# EAGLE design clock (EAGLE 5.10)
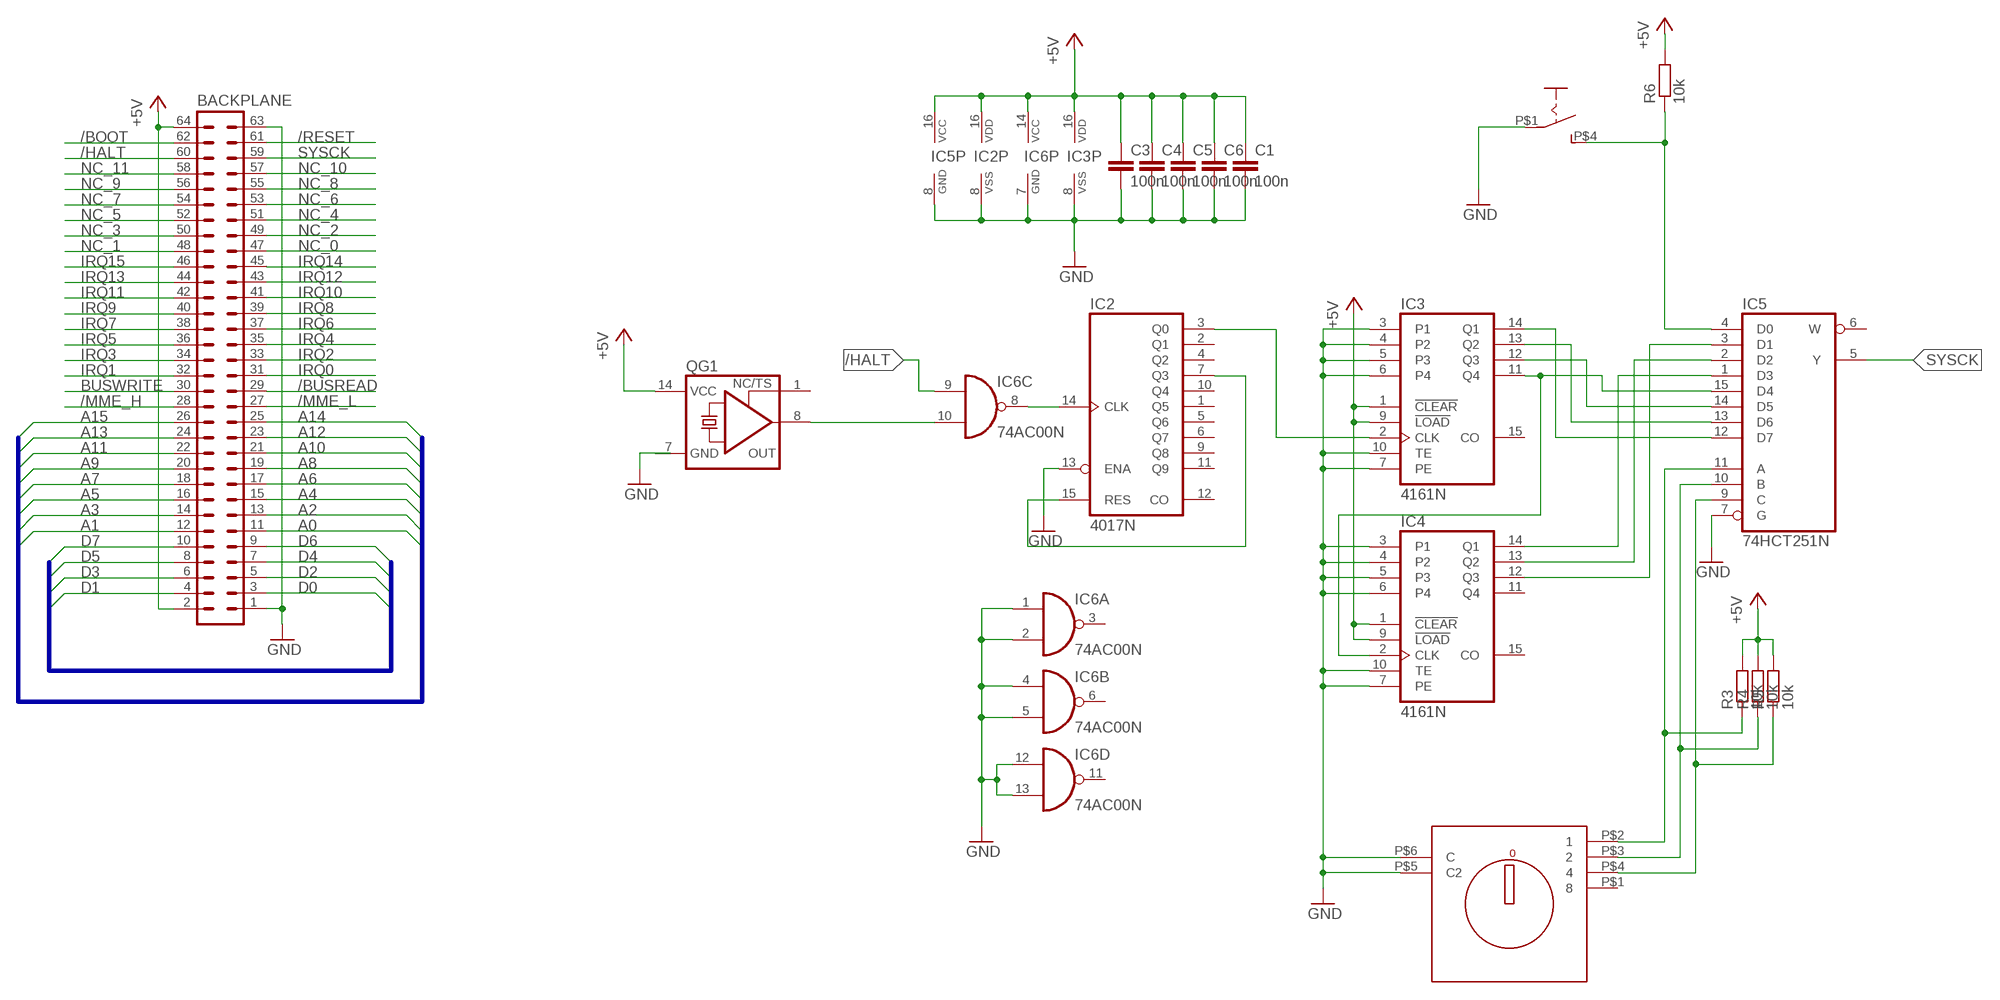
[diagram p0: schematic, sheet 1]

## Parts
BACKPLANE  ML64L  [ML64L]
C1  100n  C-EU025-025X050  [C025-025X050]
C3  100n  C-EU025-025X050  [C025-025X050]
C4  100n  C-EU025-025X050  [C025-025X050]
C5  100n  C-EU025-025X050  [C025-025X050]
C6  100n  C-EU025-025X050  [C025-025X050]
IC2  4017N  [DIL16]
IC3  4161N  [DIL16]
IC4  4161N  [DIL16]
IC5  74HCT251N  [DIL16]
IC6  74AC00N  [DIL14]
QG1  XO-14  [DIL14S]
R3  10k  R-EU_0207/12  [0207/12]
R4  10k  R-EU_0204/5  [0204/5]
R5  10k  R-EU_0207/7  [0207/7]
R6  10k  R-EU_0207/2V  [0207/2V]
U$5  KDR10H  [KDR10H]
U$6  TASTER_3305B  [TASTER_3305B]

## Nets
+5V: BACKPLANE.2 BACKPLANE.64 C1.1 C3.1 C4.1 C5.1 C6.1 IC2.16(VDD) IC3.1(!CLEAR) IC3.9(!LOAD) IC3.16(VDD) IC4.1(!CLEAR) IC4.9(!LOAD) IC5.16(VCC) IC6.14(P:VCC) QG1.14(VCC) R3.2 R4.2 R5.2 R6.2
/BOOT: BACKPLANE.62
/BUSREAD: BACKPLANE.29
/HALT: BACKPLANE.60 IC6.9(C:I0)
/MME_H: BACKPLANE.28
/MME_L: BACKPLANE.27
/RESET: BACKPLANE.61
A0: BACKPLANE.11
A1: BACKPLANE.12
A2: BACKPLANE.13
A3: BACKPLANE.14
A4: BACKPLANE.15
A5: BACKPLANE.16
A6: BACKPLANE.17
A7: BACKPLANE.18
A8: BACKPLANE.19
A9: BACKPLANE.20
A10: BACKPLANE.21
A11: BACKPLANE.22
A12: BACKPLANE.23
A13: BACKPLANE.24
A14: BACKPLANE.25
A15: BACKPLANE.26
BUSWRITE: BACKPLANE.30
D0: BACKPLANE.3
D1: BACKPLANE.4
D2: BACKPLANE.5
D3: BACKPLANE.6
D4: BACKPLANE.7
D5: BACKPLANE.8
D6: BACKPLANE.9
D7: BACKPLANE.10
GND: BACKPLANE.1 BACKPLANE.63 C1.2 C3.2 C4.2 C5.2 C6.2 IC2.8(VSS) IC2.13(ENA) IC3.3(P1) IC3.4(P2) IC3.5(P3) IC3.6(P4) IC3.7(PE) IC3.8(VSS) IC3.10(TE) IC4.3(P1) IC4.4(P2) IC4.5(P3) IC4.6(P4) IC4.7(PE) IC4.10(TE) IC5.7(G) IC5.8(GND) IC6.1(A:I0) IC6.2(A:I1) IC6.4(B:I0) IC6.5(B:I1) IC6.7(P:GND) IC6.12(D:I0) IC6.13(D:I1) U$5.P$5(C2) U$5.P$6(C) U$6.P$1(P)
IRQ0: BACKPLANE.31
IRQ1: BACKPLANE.32
IRQ2: BACKPLANE.33
IRQ3: BACKPLANE.34
IRQ4: BACKPLANE.35
IRQ5: BACKPLANE.36
IRQ6: BACKPLANE.37
IRQ7: BACKPLANE.38
IRQ8: BACKPLANE.39
IRQ9: BACKPLANE.40
IRQ10: BACKPLANE.41
IRQ11: BACKPLANE.42
IRQ12: BACKPLANE.43
IRQ13: BACKPLANE.44
IRQ14: BACKPLANE.45
IRQ15: BACKPLANE.46
N$1: IC6.10(C:I1) QG1.8(OUT)
N$5: IC3.11(Q4) IC4.2(CLK) IC5.15(D4)
N$6: IC2.7(Q3) IC2.15(RES)
N$7: IC2.3(Q0) IC3.2(CLK)
N$8: IC3.14(Q1) IC5.12(D7)
N$9: IC3.13(Q2) IC5.13(D6)
N$10: IC3.12(Q3) IC5.14(D5)
N$11: IC5.11(A) R3.1 U$5.P$2
N$12: IC4.14(Q1) IC5.1(D3)
N$13: IC4.13(Q2) IC5.2(D2)
N$14: IC4.12(Q3) IC5.3(D1)
N$15: IC5.10(B) R4.1 U$5.P$3
N$16: IC5.9(C) R5.1 U$5.P$4
N$17: IC2.14(CLK) IC6.8(C:O)
N$18: IC5.4(D0) R6.1 U$6.P$4(S)
NC_0: BACKPLANE.47
NC_1: BACKPLANE.48
NC_2: BACKPLANE.49
NC_3: BACKPLANE.50
NC_4: BACKPLANE.51
NC_5: BACKPLANE.52
NC_6: BACKPLANE.53
NC_7: BACKPLANE.54
NC_8: BACKPLANE.55
NC_9: BACKPLANE.56
NC_10: BACKPLANE.57
NC_11: BACKPLANE.58
SYSCK: BACKPLANE.59 IC5.5(Y)
Unconnected: IC2.1(Q5) IC2.2(Q1) IC2.4(Q2) IC2.5(Q6) IC2.6(Q7) IC2.9(Q8) IC2.10(Q4) IC2.11(Q9) IC2.12(CO) IC3.15(CO) IC4.11(Q4) IC4.15(CO) IC5.6(W) IC6.3(A:O) IC6.6(B:O) IC6.11(D:O) QG1.1(TS) U$5.P$1

## Buses
D[0..7]
A[0..15]

## Power pins joined to a net without a drawn wire
GND: QG1.7(GND)
VDD: IC4.16(VDD)
VSS: IC4.8(VSS)

## Library data of the parts
BACKPLANE = mcpu:ML64L: HARTING
C1 C3-C6 = rcl:C-EU: CAPACITOR, European symbol
IC2 = 40xx:4017: COUNTER/DIVIDER
IC3 IC4 = 40xx:4161: Synchronous presettable 4-bit binary COUNTER
IC5 = 74xx-eu:74*251: 1 of 8 data SELECTOR/MULTIPLEXER, 3-state
IC6 = 74xx-eu:74*00: Quad 2-input NAND gate
QG1 = crystal:XO-: CRYSTAL
R3-R6 = rcl:R-EU_: RESISTOR, European symbol
U$5 = Drehschalter:KDR10H
U$6 = mcpu:TASTER_3305B

## Net classes
0 Signal: width 0.254 mm, drill 0.508 mm, clearance 0.203 mm
1 LoVolt42: width 0.61 mm, drill 0.508 mm, clearance 0.813 mm to class 0, clearance 0.305 mm
2 MedVolt100: width 0.61 mm, drill 0.508 mm, clearance 1.626 mm to class 0, clearance 1.626 mm to class 1, clearance 0.813 mm
3 LineVolt350: width 0.813 mm, drill 0.508 mm, clearance 12.7 mm to class 0, clearance 12.7 mm to class 1, clearance 12.7 mm to class 2, clearance 2.54 mm

## Board
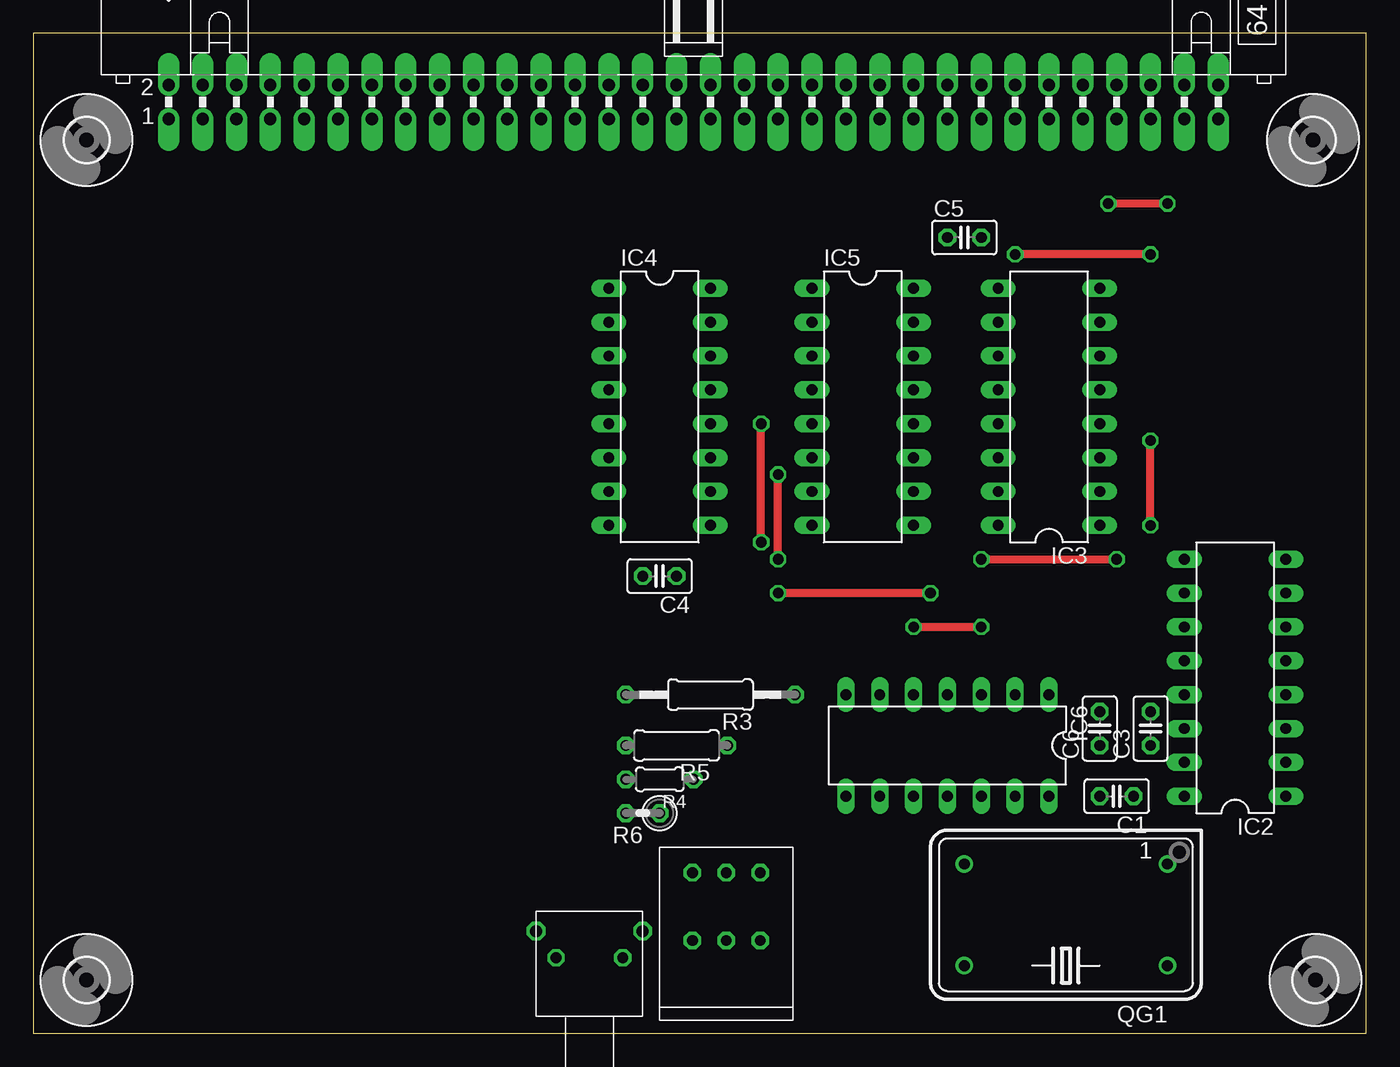
[diagram p1: board, top side]
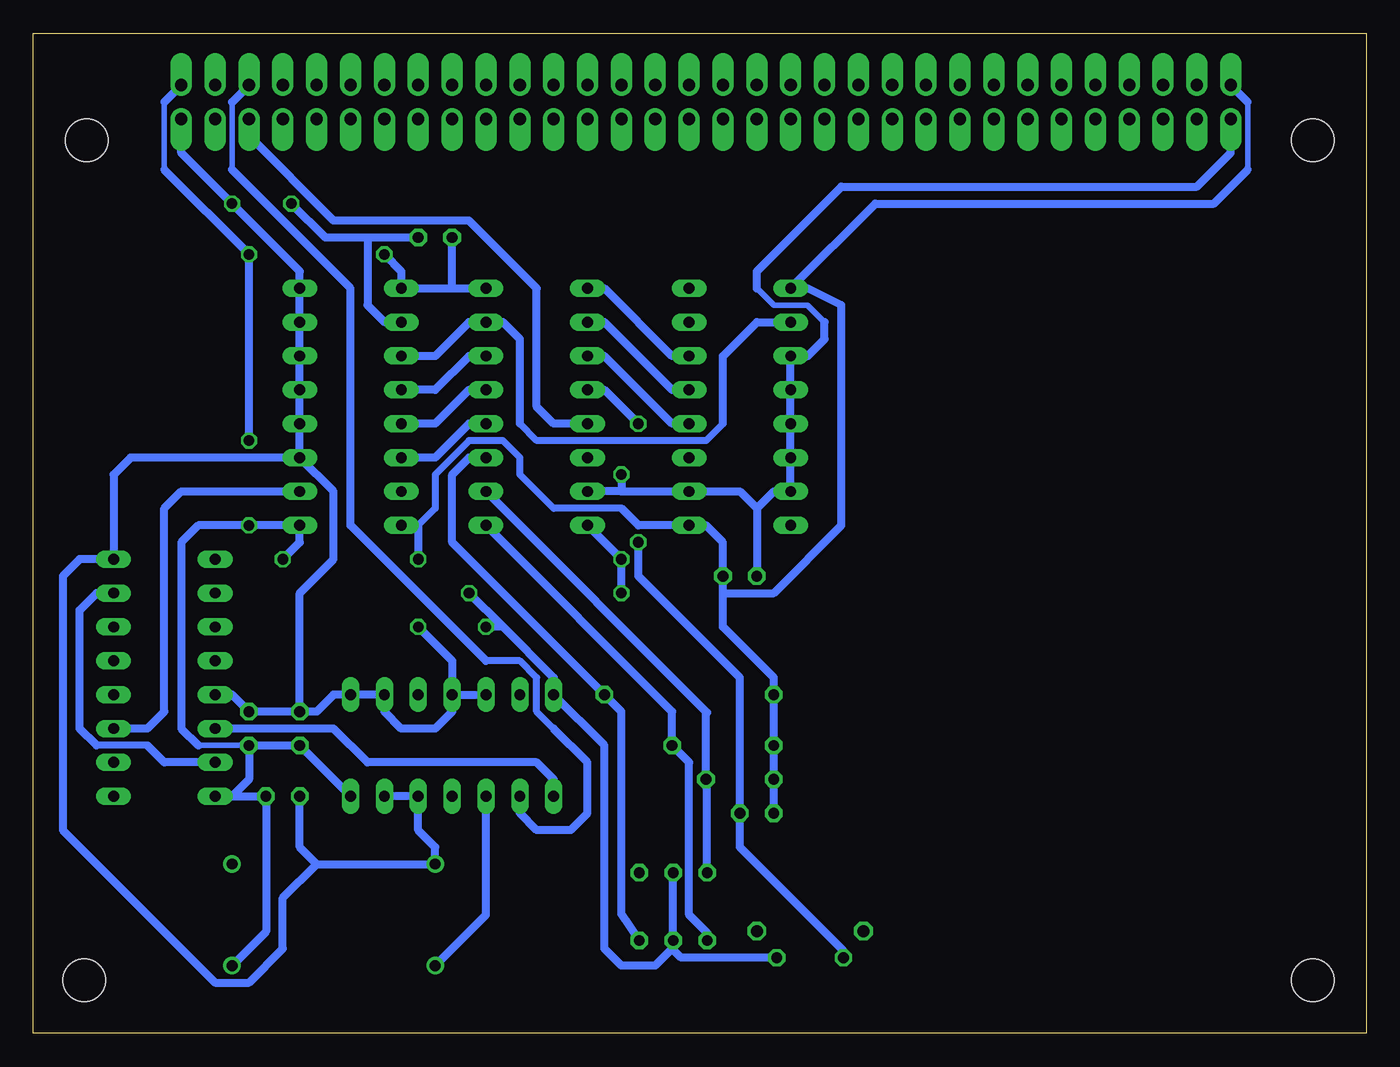
[diagram p2: board, bottom side, seen from below]

Size 100 x 75 mm. Coordinates in mm from the lower left corner, seen from the top.
Outline: 0,0 100,0 100,75 0,75 0,0
Copper layers (1*16): Top 0.035mm / dielectric 1.5mm / Bottom 0.035mm
Design rules "default": minimum track width 10mil, minimum drill 24mil, track to track 8mil, track to pad 8mil, pad to pad 8mil, via to via 8mil, smd to smd 8mil, copper to edge 40mil, drill to drill 8mil, minimum pad ring 10mil, minimum via ring 8mil, stop-mask expansion 4mil, vias tented up to drill 0mil, thermal gap 10mil

### Footprints (pad centres in the part's own frame; a part is rotated, then mirrored left to right if it is on the bottom)
ML64L = drill 0.914 pad 1.6 offset: 1 -39.37,-1.27; 2 -39.37,1.27; 3 -36.83,-1.27; 4 -36.83,1.27; 5 -34.29,-1.27; 6 -34.29,1.27; 7 -31.75,-1.27; 8 -31.75,1.27; 9 -29.21,-1.27; 10 -29.21,1.27; 11 -26.67,-1.27; 12 -26.67,1.27; 13 -24.13,-1.27; 14 -24.13,1.27; 15 -21.59,-1.27; 16 -21.59,1.27; 17 -19.05,-1.27; 18 -19.05,1.27; 19 -16.51,-1.27; 20 -16.51,1.27; 21 -13.97,-1.27; 22 -13.97,1.27; 23 -11.43,-1.27; 24 -11.43,1.27; 25 -8.89,-1.27; 26 -8.89,1.27; 27 -6.35,-1.27; 28 -6.35,1.27; 29 -3.81,-1.27; 30 -3.81,1.27; 31 -1.27,-1.27; 32 -1.27,1.27; 33 1.27,-1.27; 34 1.27,1.27; 35 3.81,-1.27; 36 3.81,1.27; 37 6.35,-1.27; 38 6.35,1.27; 39 8.89,-1.27; 40 8.89,1.27; 41 11.43,-1.27; 42 11.43,1.27; 43 13.97,-1.27; 44 13.97,1.27; 45 16.51,-1.27; 46 16.51,1.27; 47 19.05,-1.27; 48 19.05,1.27; 49 21.59,-1.27; 50 21.59,1.27; 51 24.13,-1.27; 52 24.13,1.27; 53 26.67,-1.27; 54 26.67,1.27; 55 29.21,-1.27; 56 29.21,1.27; 57 31.75,-1.27; 58 31.75,1.27; 59 34.29,-1.27; 60 34.29,1.27; 61 36.83,-1.27; 62 36.83,1.27; 63 39.37,-1.27; 64 39.37,1.27
C025-025X050 = drill 0.813 octagon: 1 -1.27,0; 2 1.27,0
DIL16 = drill 0.813 long: 1 -8.89,-3.81; 2 -6.35,-3.81; 3 -3.81,-3.81; 4 -1.27,-3.81; 5 1.27,-3.81; 6 3.81,-3.81; 7 6.35,-3.81; 8 8.89,-3.81; 9 8.89,3.81; 10 6.35,3.81; 11 3.81,3.81; 12 1.27,3.81; 13 -1.27,3.81; 14 -3.81,3.81; 15 -6.35,3.81; 16 -8.89,3.81
DIL14 = drill 0.813 long: 1 -7.62,-3.81; 2 -5.08,-3.81; 3 -2.54,-3.81; 4 0,-3.81; 5 2.54,-3.81; 6 5.08,-3.81; 7 7.62,-3.81; 8 7.62,3.81; 9 5.08,3.81; 10 2.54,3.81; 11 0,3.81; 12 -2.54,3.81; 13 -5.08,3.81; 14 -7.62,3.81
DIL14S = drill 0.813 round: 1 -7.62,-3.81; 7 7.62,-3.81; 8 7.62,3.81; 14 -7.62,3.81
0207/12 = drill 0.813 octagon: 1 -6.35,0; 2 6.35,0
0204/5 = drill 0.813 octagon: 1 -2.54,0; 2 2.54,0
0207/7 = drill 0.813 octagon: 1 -3.81,0; 2 3.81,0
0207/2V = drill 0.813 octagon: 1 -1.27,0; 2 1.27,0
3,2 = hole 3.2: 0,0
KDR10H = drill 0.8 octagon: P$1 1.92,7.54; P$2 7,7.54; P$3 1.92,2.46; P$4 7,2.46; P$5 7,5; P$6 1.92,5
TASTER_3305B = drill 0.8 octagon: P$1 4.4,1.5; P$4 4.4,6.5 | drill 0.9 octagon: P$2 6.4,8; P$3 6.4,0

### Placement (x,y rotation side)
BACKPLANE  49.53,69.85 0 top
C1  81.28,17.78 180 top
C3  83.82,22.86 90 top
C4  46.99,34.29 180 top
C5  69.85,59.69 0 top
C6  80.01,22.86 90 top
IC2  90.17,26.67 90 top
IC3  76.2,46.99 90 top
IC4  46.99,46.99 270 top
IC5  62.23,46.99 270 top
IC6  68.58,21.59 180 top
QG1  77.47,8.89 180 top
R3  50.8,25.4 180 top
R4  46.99,19.05 180 top
R5  48.26,21.59 180 top
R6  45.72,16.51 180 top
U$1  [3,2]  4,4 0 top
U$2  [3,2]  4,67 0 top
U$3  [3,2]  96,67 0 top
U$4  [3,2]  96.19,4 0 top
U$5  46.99,13.97 270 top
U$6  45.72,1.27 90 top

### Tracks (layer width: path | path; a pad name or v marks a point on that pad's centre or on a via)
+5V  (via drill 0.8)
  Top 0.61: v83.82,58.42 v73.66,58.42 | v83.82,38.1 v83.82,44.45 | v71.12,35.56 v81.28,35.56
  Bottom 0.406: 90.17,64.77 90.17,69.85 | 87.63,21.59 C3.1 | 8.89,64.77 8.89,69.85
  Bottom 0.508: 55.88,39.37 60.96,39.37 63.5,41.91 63.5,43.18 64.77,44.45 67.31,44.45 69.85,41.91 69.85,39.37 71.12,38.1 IC3.16
  Bottom 0.61: 85.09,17.78 IC2.16 | 85.09,17.78 83.82,19.05 C3.1 C6.1 IC6.14 | QG1.14 82.55,7.62 C1.1 85.09,17.78 | 90.17,69.85 BACKPLANE.64 | 90.17,64.77 v83.82,58.42 v83.82,44.45 | v73.66,58.42 72.39,57.15 IC3.9 68.58,55.88 | 68.58,55.88 IC5.16 | 68.58,55.88 C5.1 | 48.26,33.02 48.26,30.48 44.45,26.67 R3.2 R5.2 R4.2 R6.2 | 55.88,39.37 54.61,38.1 IC4.9 49.53,38.1 48.26,36.83 C4.1 48.26,33.02 | 48.26,33.02 44.45,33.02 39.37,38.1 39.37,54.61 41.91,55.88 IC4.1 36.83,62.23 11.43,62.23 8.89,64.77 | 87.63,21.59 88.9,22.86 88.9,36.83 87.63,38.1 v83.82,38.1 IC3.1 80.01,36.83 v81.28,35.56 | 71.12,38.1 v71.12,35.56 | 8.89,69.85 BACKPLANE.2
/HALT
  Bottom 0.406: 85.09,64.77 85.09,69.85
  Bottom 0.508: 60.96,22.86 62.23,24.13 62.23,26.67 63.5,27.94 66.04,27.94
  Bottom 0.61: 66.04,27.94 76.2,38.1 76.2,55.88 85.09,64.77 | 85.09,69.85 BACKPLANE.60 | IC6.9 63.5,16.51 62.23,15.24 59.69,15.24 58.42,16.51 58.42,20.32 60.96,22.86
GND  (via drill 0.8)
  Top 0.61: v66.04,30.48 v71.12,30.48 | v55.88,35.56 v55.88,41.91 | v67.31,33.02 v55.88,33.02 | v85.09,62.23 v80.64,62.23
  Bottom 0.406: 45.72,55.88 44.45,54.61 41.91,54.61 40.64,53.34
  Bottom 0.61: IC3.3 92.71,43.18 93.98,41.91 IC2.8 96.52,35.56 97.79,34.29 97.79,15.24 86.36,3.81 83.82,3.81 81.28,6.35 81.28,10.16 78.74,12.7 | BACKPLANE.63 88.9,66.04 v85.09,62.23 80.01,57.15 IC3.8 IC3.7 IC3.6 IC3.5 IC3.4 IC3.3 | C6.2 78.74,24.13 77.47,25.4 IC6.1 IC6.2 73.66,24.13 72.39,22.86 69.85,22.86 68.58,24.13 IC6.4 | IC6.13 IC6.12 71.12,15.24 69.85,13.97 QG1.7 78.74,12.7 | C1.2 80.01,13.97 78.74,12.7 | 45.72,39.37 44.45,40.64 IC4.7 IC4.6 IC4.5 IC4.4 IC4.3 41.91,50.8 40.64,52.07 40.64,53.34 | 45.72,39.37 C4.2 | 45.72,39.37 46.99,40.64 IC4.10 55.88,40.64 | 55.88,40.64 IC5.7 | IC2.13 85.09,25.4 C3.2 C6.2 | C6.2 80.01,33.02 77.47,35.56 77.47,40.64 IC3.3 | U$5.P$6 U$5.P$5 52.07,6.89 52.07,6.35 | 52.07,6.35 53.34,5.08 55.88,5.08 57.15,6.35 57.15,21.59 IC6.7 60.96,26.67 64.77,30.48 | U$6.P$1 51.39,5.67 52.07,6.35 | 74.93,59.69 C5.2 | 74.93,59.69 74.93,54.61 73.66,53.34 IC3.10 | IC6.4 IC6.5 | IC6.4 68.58,27.94 v71.12,30.48 | 64.77,30.48 v66.04,30.48 | IC5.8 v55.88,35.56 v55.88,33.02 | v55.88,41.91 55.88,40.64 | 64.77,30.48 v67.31,33.02 | 74.93,59.69 78.11,59.69 v80.64,62.23 | BACKPLANE.1 10.16,66.04 12.7,63.5 39.37,63.5 45.72,57.15 45.72,55.88
N$1
  Bottom 0.61: QG1.8 66.04,8.89 IC6.10
N$5
  Bottom 0.508: 48.26,45.72 49.53,44.45 62.23,44.45 63.5,45.72
  Bottom 0.61: IC3.11 69.85,50.8 67.31,53.34 IC5.15 64.77,53.34 63.5,52.07 63.5,45.72 | IC4.2 45.72,53.34 48.26,50.8 48.26,45.72
N$6
  Bottom 0.508: 91.44,21.59 95.25,21.59
  Bottom 0.61: IC2.7 95.25,33.02 96.52,31.75 96.52,22.86 95.25,21.59 | 91.44,21.59 90.17,20.32 IC2.15
N$7
  Bottom 0.61: IC2.3 91.44,22.86 90.17,24.13 90.17,39.37 88.9,40.64 IC3.2
N$8
  Bottom 0.61: IC3.14 69.85,43.18 67.31,45.72 IC5.12
N$9
  Bottom 0.61: IC3.13 69.85,45.72 67.31,48.26 IC5.13
N$10
  Bottom 0.61: IC3.12 69.85,48.26 67.31,50.8 IC5.14
N$11
  Bottom 0.61: IC5.11 67.31,43.18 68.58,41.91 68.58,36.83 R3.1 55.88,24.13 55.88,8.96 U$5.P$2
N$12
  Bottom 0.61: IC4.14 52.07,50.8 57.15,55.88 IC5.1
N$13
  Bottom 0.61: IC4.13 52.07,48.26 57.15,53.34 IC5.2
N$14
  Bottom 0.61: IC4.12 52.07,45.72 57.15,50.8 IC5.3
N$15
  Bottom 0.61: IC5.10 49.45,24.05 49.53,23.97 R4.1 49.45,18.97 U$5.P$3
N$16
  Bottom 0.61: U$5.P$4 49.45,7.54 50.8,8.89 50.8,20.32 R5.1 52.07,24.13 IC5.9
N$17
  Bottom 0.61: IC6.8 60.96,19.05 62.23,20.32 74.93,20.32 77.47,22.86 IC2.14
N$18  (via drill 0.8)
  Top 0.61: v54.61,36.83 v54.61,45.72
  Bottom 0.61: U$6.P$4 39.22,6.2 46.99,13.97 R6.1 46.99,26.67 54.61,34.29 v54.61,36.83 | v54.61,45.72 57.15,48.26 IC5.4
SYSCK
  Bottom 0.61: IC5.5 60.96,45.72 62.23,46.99 62.23,55.88 67.31,60.96 77.47,60.96 83.82,67.31 BACKPLANE.59